# EAGLE design Display18_Cape (EAGLE 7.7.0)
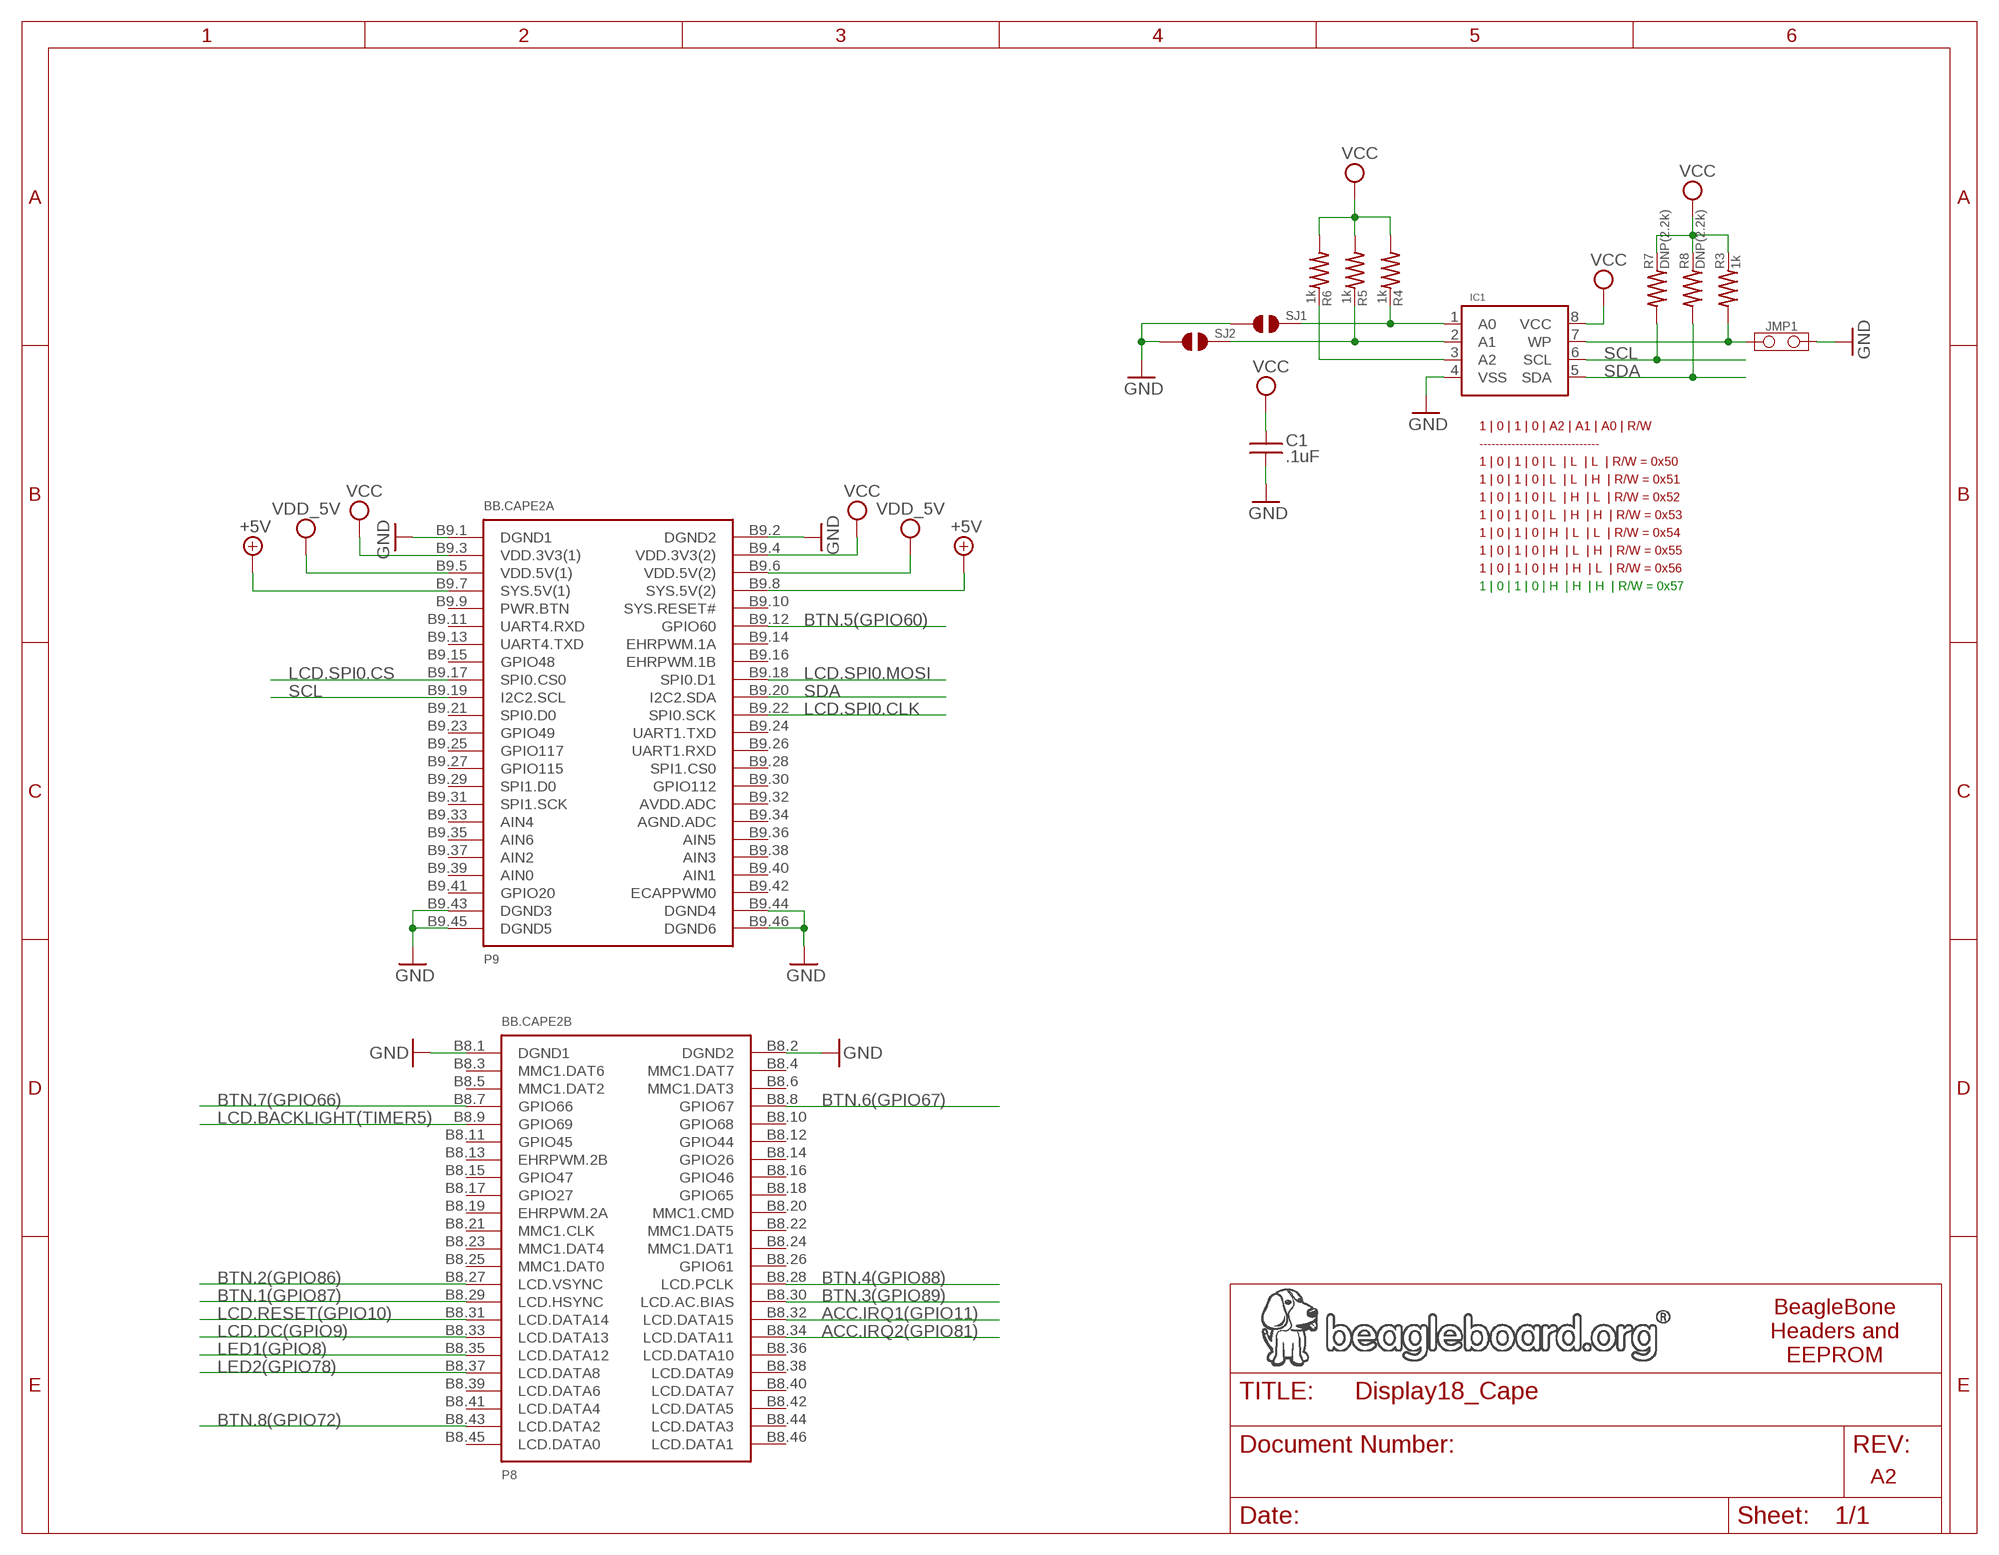
[diagram p0: schematic, sheet 1, part 1 of 2]
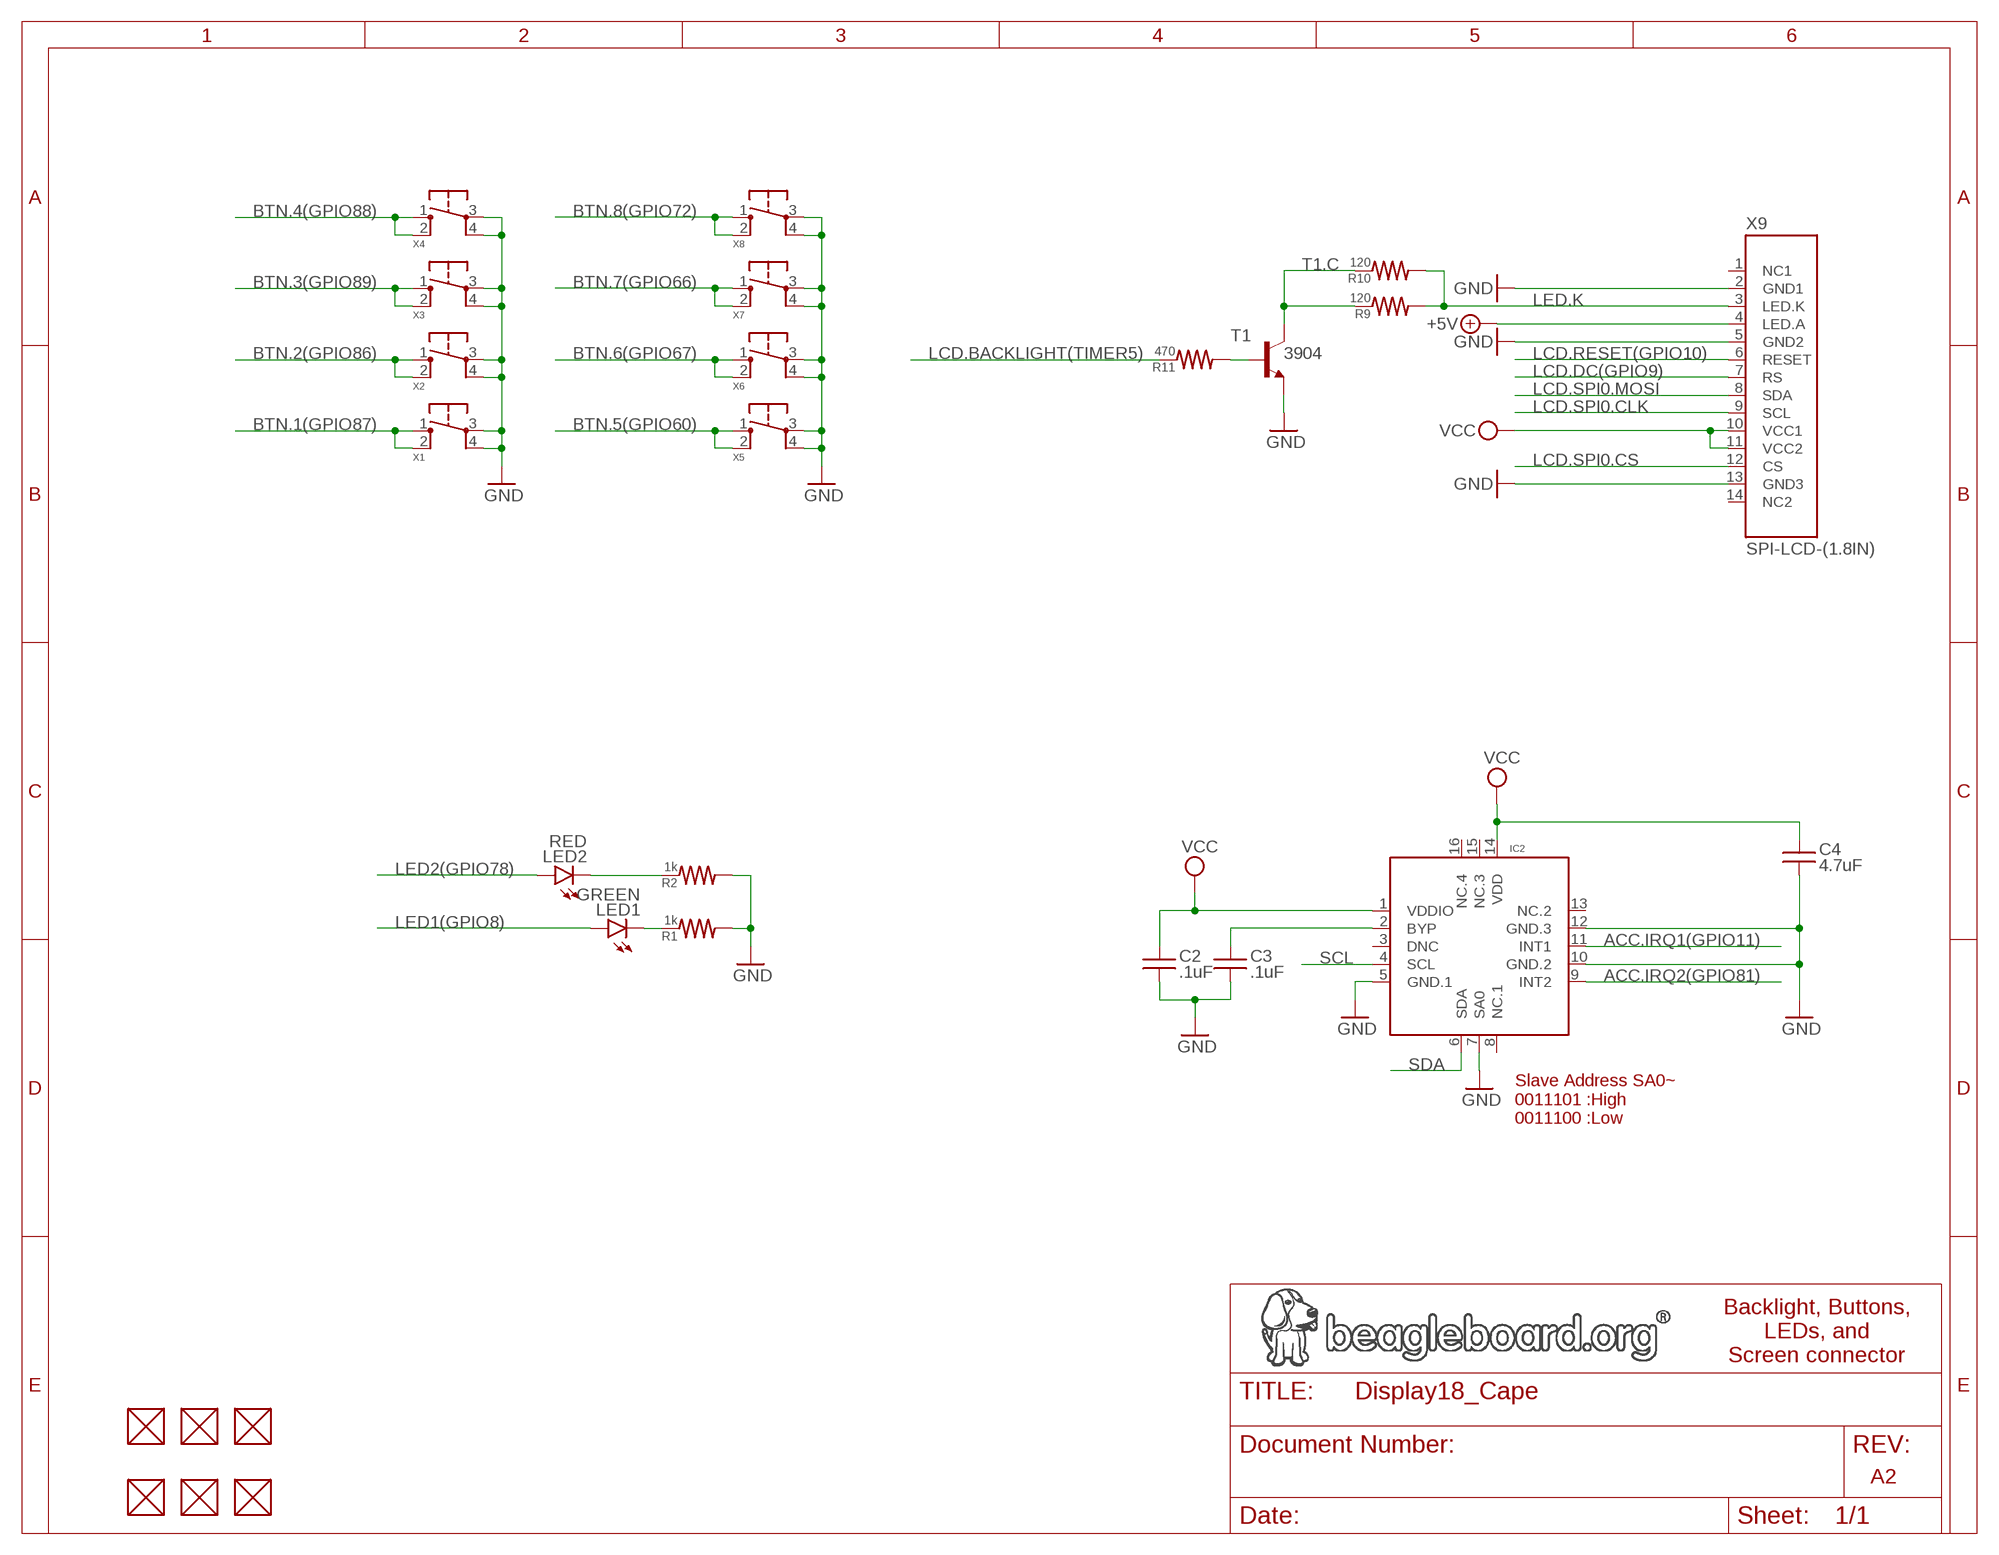
[diagram p1: schematic, sheet 1, part 2 of 2]

## Parts
BB.CAPE2  BEAGLEBONE.CAPE.BOTTOM-ONLY-PADS  [BEAGLEBONE.CAPE.BOTTOM-ONLY-PADS]
C1  .1uF  CAPACITOR-(INCH)-0402  [0402]
C2  .1uF  CAPACITOR-(INCH)-0402  [0402]
C3  .1uF  CAPACITOR-(INCH)-0402  [0402]
C4  4.7uF  CAPACITOR-(INCH)-0603  [0603]
FUD1  FIDUCIAL  [FIDUCIAL_40MIL]
FUD2  FIDUCIAL  [FIDUCIAL_40MIL]
FUD3  FIDUCIAL  [FIDUCIAL_40MIL]
FUD4  FIDUCIAL  [FIDUCIAL_40MIL]
FUD5  FIDUCIAL  [FIDUCIAL_40MIL]
FUD6  FIDUCIAL  [FIDUCIAL_40MIL]
IC1  CAT24C32  [UDFN8,2X3(ON-SEMI)]
IC2  MMA8453Q  [QFN-16-(MMA8453Q)]
JMP1  JUMPER-(X2)  [JUMPER-(X2)]
LED1  GREEN  LED-(INCH)-0805  [0805-LED]
LED2  RED  LED-(INCH)-0805  [0805-LED]
R1  1k  RESISTOR-(INCH)-0402  [0402]
R2  1k  RESISTOR-(INCH)-0402  [0402]
R3  1k  RESISTOR-(INCH)-0402  [0402]
R4  1k  RESISTOR-(INCH)-0402  [0402]
R5  1k  RESISTOR-(INCH)-0402  [0402]
R6  1k  RESISTOR-(INCH)-0402  [0402]
R7  DNP(2.2k)  RESISTOR-(INCH)-0402  [0402]
R8  DNP(2.2k)  RESISTOR-(INCH)-0402  [0402]
R9  120  RESISTOR-(INCH)-0603  [0603]
R10  120  RESISTOR-(INCH)-0603  [0603]
R11  470  RESISTOR-(INCH)-0603  [0603]
SJ1  SOLDER.JOINT-(INCH)-0402  [SOLDER.JOINT(0402)]
SJ2  SOLDER.JOINT-(INCH)-0402  [SOLDER.JOINT(0402)]
T1  3904  BC847-NPN-SOT23-BEC  [SOT23-BEC]
X1  6MM_TACTILE_SWITCH  [6MM_TACTILE-SWITCH]
X2  6MM_TACTILE_SWITCH  [6MM_TACTILE-SWITCH]
X3  6MM_TACTILE_SWITCH  [6MM_TACTILE-SWITCH]
X4  6MM_TACTILE_SWITCH  [6MM_TACTILE-SWITCH]
X5  6MM_TACTILE_SWITCH  [6MM_TACTILE-SWITCH]
X6  6MM_TACTILE_SWITCH  [6MM_TACTILE-SWITCH]
X7  6MM_TACTILE_SWITCH  [6MM_TACTILE-SWITCH]
X8  6MM_TACTILE_SWITCH  [6MM_TACTILE-SWITCH]
X9  SPI-LCD-(1.8IN)  [LCD-(1.8IN)]

## Nets
+5V: BB.CAPE2.B9.7(A:SYS.5V(1)) BB.CAPE2.B9.8(A:SYS.5V(2)) X9.4(LED.A)
A0: IC1.1(A0) R4.2 SJ1.2
A1: IC1.2(A1) R5.2 SJ2.2
A2: IC1.3(A2) R6.2
ACC.IRQ1(GPIO11): BB.CAPE2.B8.32(B:LCD.DATA15) IC2.11(INT1)
ACC.IRQ2(GPIO81): BB.CAPE2.B8.34(B:LCD.DATA11) IC2.9(INT2)
BTN.1(GPIO87): BB.CAPE2.B8.29(B:LCD.HSYNC) X1.1 X1.2
BTN.2(GPIO86): BB.CAPE2.B8.27(B:LCD.VSYNC) X2.1 X2.2
BTN.3(GPIO89): BB.CAPE2.B8.30(B:LCD.AC.BIAS) X3.1 X3.2
BTN.4(GPIO88): BB.CAPE2.B8.28(B:LCD.PCLK) X4.1 X4.2
BTN.5(GPIO60): BB.CAPE2.B9.12(A:GPIO60) X5.1 X5.2
BTN.6(GPIO67): BB.CAPE2.B8.8(B:GPIO67) X6.1 X6.2
BTN.7(GPIO66): BB.CAPE2.B8.7(B:GPIO66) X7.1 X7.2
BTN.8(GPIO72): BB.CAPE2.B8.43(B:LCD.DATA2) X8.1 X8.2
GND: BB.CAPE2.B8.1(B:DGND1) BB.CAPE2.B8.2(B:DGND2) BB.CAPE2.B9.1(A:DGND1) BB.CAPE2.B9.2(A:DGND2) BB.CAPE2.B9.43(A:DGND3) BB.CAPE2.B9.44(A:DGND4) BB.CAPE2.B9.45(A:DGND5) BB.CAPE2.B9.46(A:DGND6) C1.2 C2.2 C3.2 C4.2 IC1.4(VSS) IC2.5(GND.1) IC2.7(SA0) IC2.10(GND.2) IC2.12(GND.3) JMP1.2 R1.1 R2.1 SJ1.1 SJ2.1 T1.E X1.3 X1.4 X2.3 X2.4 X3.3 X3.4 X4.3 X4.4 X5.3 X5.4 X6.3 X6.4 X7.3 X7.4 X8.3 X8.4 X9.2(GND1) X9.5(GND2) X9.13(GND3)
LCD.BACKLIGHT(TIMER5): BB.CAPE2.B8.9(B:GPIO69) R11.2
LCD.DC(GPIO9): BB.CAPE2.B8.33(B:LCD.DATA13) X9.7(RS)
LCD.RESET(GPIO10): BB.CAPE2.B8.31(B:LCD.DATA14) X9.6(RESET)
LCD.SPI0.CLK: BB.CAPE2.B9.22(A:SPI0.SCK) X9.9(SCL)
LCD.SPI0.CS: BB.CAPE2.B9.17(A:SPI0.CS0) X9.12(CS)
LCD.SPI0.MOSI: BB.CAPE2.B9.18(A:SPI0.D1) X9.8(SDA)
LED1(GPIO8): BB.CAPE2.B8.35(B:LCD.DATA12) LED1.A
LED2(GPIO78): BB.CAPE2.B8.37(B:LCD.DATA8) LED2.A
LED.K: R9.1 R10.1 X9.3(LED.K)
N$3: LED2.K R2.2
N$4: LED1.K R1.2
N$5: R11.1 T1.B
N$6: C3.1 IC2.2(BYP)
SCL: BB.CAPE2.B9.19(A:I2C2.SCL) IC1.6(SCL) IC2.4(SCL) R7.1
SDA: BB.CAPE2.B9.20(A:I2C2.SDA) IC1.5(SDA) IC2.6(SDA) R8.1
T1.C: R9.2 R10.2 T1.C
VCC: BB.CAPE2.B9.3(A:VDD.3V3(1)) BB.CAPE2.B9.4(A:VDD.3V3(2)) C1.1 C2.1 C4.1 IC1.8(VCC) IC2.1(VDDIO) IC2.14(VDD) R3.2 R4.1 R5.1 R6.1 R7.2 R8.2 X9.10(VCC1) X9.11(VCC2)
VDD_5V: BB.CAPE2.B9.5(A:VDD.5V(1)) BB.CAPE2.B9.6(A:VDD.5V(2))
WP: IC1.7(WP) JMP1.1 R3.1
Unconnected: BB.CAPE2.B8.3(B:MMC1.DAT6) BB.CAPE2.B8.4(B:MMC1.DAT7) BB.CAPE2.B8.5(B:MMC1.DAT2) BB.CAPE2.B8.6(B:MMC1.DAT3) BB.CAPE2.B8.10(B:GPIO68) BB.CAPE2.B8.11(B:GPIO45) BB.CAPE2.B8.12(B:GPIO44) BB.CAPE2.B8.13(B:EHRPWM.2B) BB.CAPE2.B8.14(B:GPIO26) BB.CAPE2.B8.15(B:GPIO47) BB.CAPE2.B8.16(B:GPIO46) BB.CAPE2.B8.17(B:GPIO27) BB.CAPE2.B8.18(B:GPIO65) BB.CAPE2.B8.19(B:EHRPWM.2A) BB.CAPE2.B8.20(B:MMC1.CMD) BB.CAPE2.B8.21(B:MMC1.CLK) BB.CAPE2.B8.22(B:MMC1.DAT5) BB.CAPE2.B8.23(B:MMC1.DAT4) BB.CAPE2.B8.24(B:MMC1.DAT1) BB.CAPE2.B8.25(B:MMC1.DAT0) BB.CAPE2.B8.26(B:GPIO61) BB.CAPE2.B8.36(B:LCD.DATA10) BB.CAPE2.B8.38(B:LCD.DATA9) BB.CAPE2.B8.39(B:LCD.DATA6) BB.CAPE2.B8.40(B:LCD.DATA7) BB.CAPE2.B8.41(B:LCD.DATA4) BB.CAPE2.B8.42(B:LCD.DATA5) BB.CAPE2.B8.44(B:LCD.DATA3) BB.CAPE2.B8.45(B:LCD.DATA0) BB.CAPE2.B8.46(B:LCD.DATA1) BB.CAPE2.B9.9(A:PWR.BTN) BB.CAPE2.B9.10(A:SYS.RESET#) BB.CAPE2.B9.11(A:UART4.RXD) BB.CAPE2.B9.13(A:UART4.TXD) BB.CAPE2.B9.14(A:EHRPWM.1A) BB.CAPE2.B9.15(A:GPIO48) BB.CAPE2.B9.16(A:EHRPWM.1B) BB.CAPE2.B9.21(A:SPI0.D0) BB.CAPE2.B9.23(A:GPIO49) BB.CAPE2.B9.24(A:UART1.TXD) BB.CAPE2.B9.25(A:GPIO117) BB.CAPE2.B9.26(A:UART1.RXD) BB.CAPE2.B9.27(A:GPIO115) BB.CAPE2.B9.28(A:SPI1.CS0) BB.CAPE2.B9.29(A:SPI1.D0) BB.CAPE2.B9.30(A:GPIO112) BB.CAPE2.B9.31(A:SPI1.SCK) BB.CAPE2.B9.32(A:AVDD.ADC) BB.CAPE2.B9.33(A:AIN4) BB.CAPE2.B9.34(A:AGND.ADC) BB.CAPE2.B9.35(A:AIN6) BB.CAPE2.B9.36(A:AIN5) BB.CAPE2.B9.37(A:AIN2) BB.CAPE2.B9.38(A:AIN3) BB.CAPE2.B9.39(A:AIN0) BB.CAPE2.B9.40(A:AIN1) BB.CAPE2.B9.41(A:GPIO20) BB.CAPE2.B9.42(A:ECAPPWM0) FUD1.P$1 FUD2.P$1 FUD3.P$1 FUD4.P$1 FUD5.P$1 FUD6.P$1 IC2.3(DNC) IC2.8(NC.1) IC2.13(NC.2) IC2.15(NC.3) IC2.16(NC.4) X9.1(NC1) X9.14(NC2)

## Notes on the sheet
- 1 | 0 | 1 | 0 | A2 | A1 | A0 | R/W
- ------------------------------
- 1 | 0 | 1 | 0 | L  | L  | L  | R/W = 0x50
- 1 | 0 | 1 | 0 | L  | L  | H  | R/W = 0x51
- 1 | 0 | 1 | 0 | L  | H  | L  | R/W = 0x52
- 1 | 0 | 1 | 0 | L  | H  | H  | R/W = 0x53
- 1 | 0 | 1 | 0 | H  | L  | L  | R/W = 0x54
- 1 | 0 | 1 | 0 | H  | L  | H  | R/W = 0x55
- 1 | 0 | 1 | 0 | H  | H  | L  | R/W = 0x56
- 1 | 0 | 1 | 0 | H  | H  | H  | R/W = 0x57
- Slave Address SA0~
  0011101 :High
  0011100 :Low
- BeagleBone
  Headers and
  EEPROM
- Backlight, Buttons,
  LEDs, and
  Screen connector
- A2 | A2

## Library data of the parts
BB.CAPE2 = GHI-Solutions:BEAGLEBONE.CAPE
C1-C4 = GHI-BasicComponents:CAPACITOR-(INCH)-: Basic SMD ceramic capacitors
FUD1-FUD6 = GHI:FIDUCIAL
IC1 = GHI-IC:CAT24C32: 32-Kb I2C CMOS Serial EEPROM
IC2 = GHI-IC:MMA8453Q: MMA8453Q, 3-axis, 10-bit/8-bit digital accelerometer
JMP1 = GHI-Headers:JUMPER-(X2)
LED1 LED2 = GHI-BasicComponents:LED-(INCH)-: Basic SMD LEDs
R1-R11 = GHI-BasicComponents:RESISTOR-(INCH)-: Basic SMD Resistors
SJ1 SJ2 = GHI-Miscellaneous:SOLDER.JOINT-(INCH)-: Solder Joint (Bridge) Pads - For easy solder joining.
T1 = transistor:*-NPN-: NPN Transistror BF959 corrected 2008.03.06
X1-X8 = GHI2:6MM_TACTILE_SWITCH
X9 = GHI-Connectors:SPI-LCD-(1.8IN)

## Board
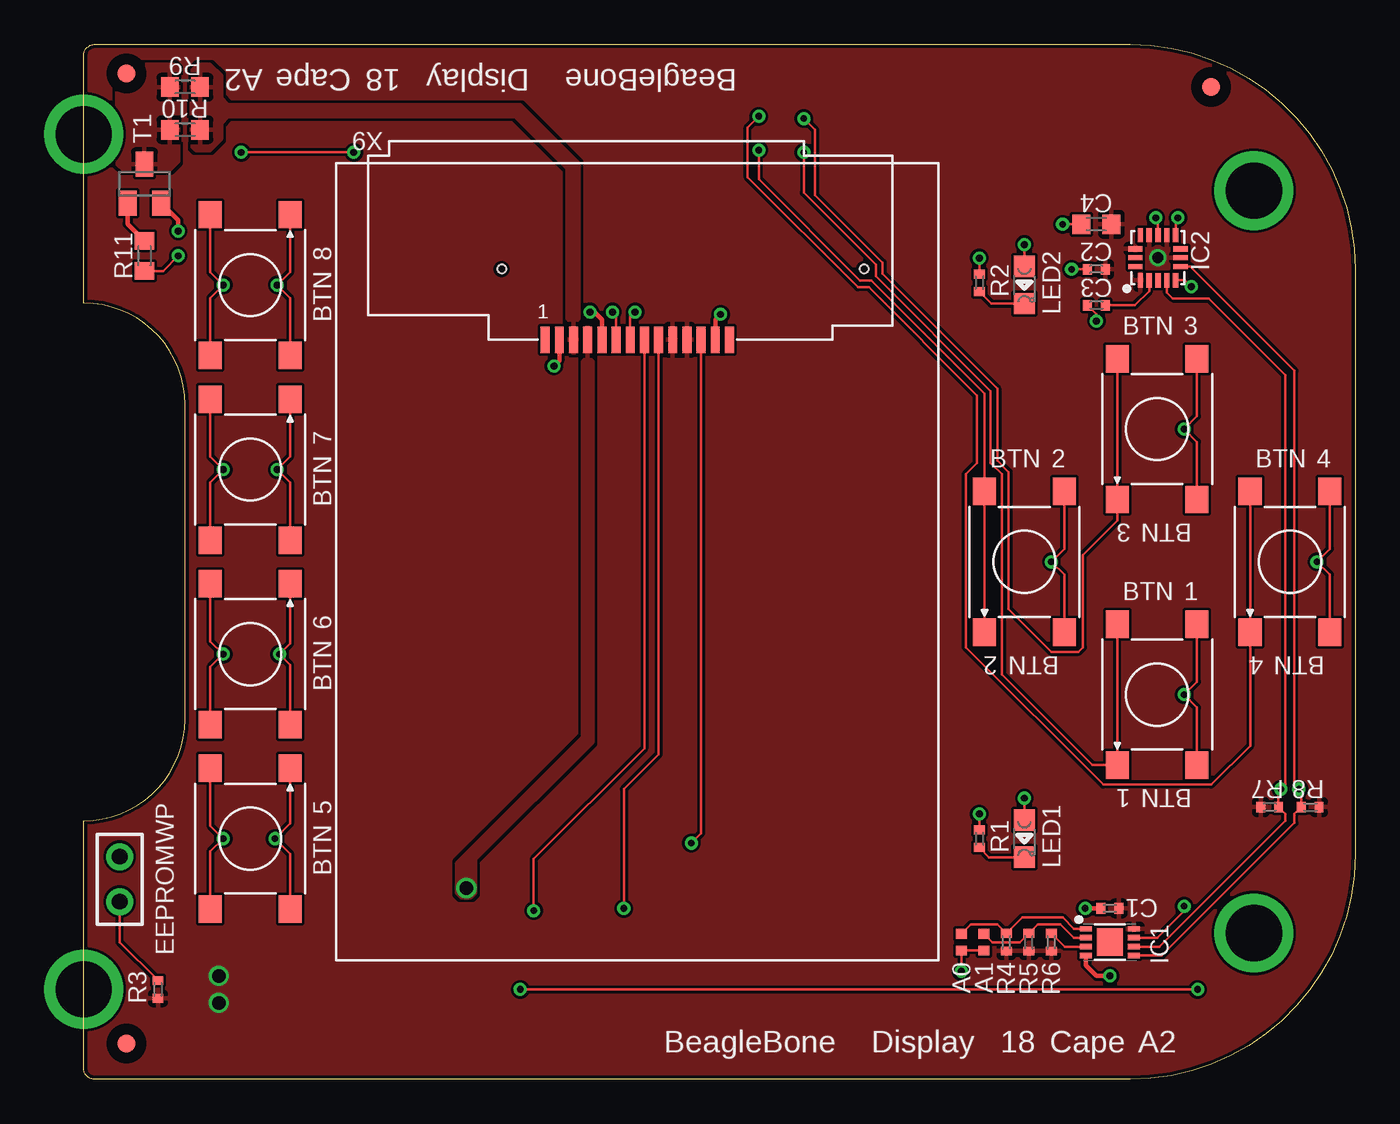
[diagram p2: board, top side]
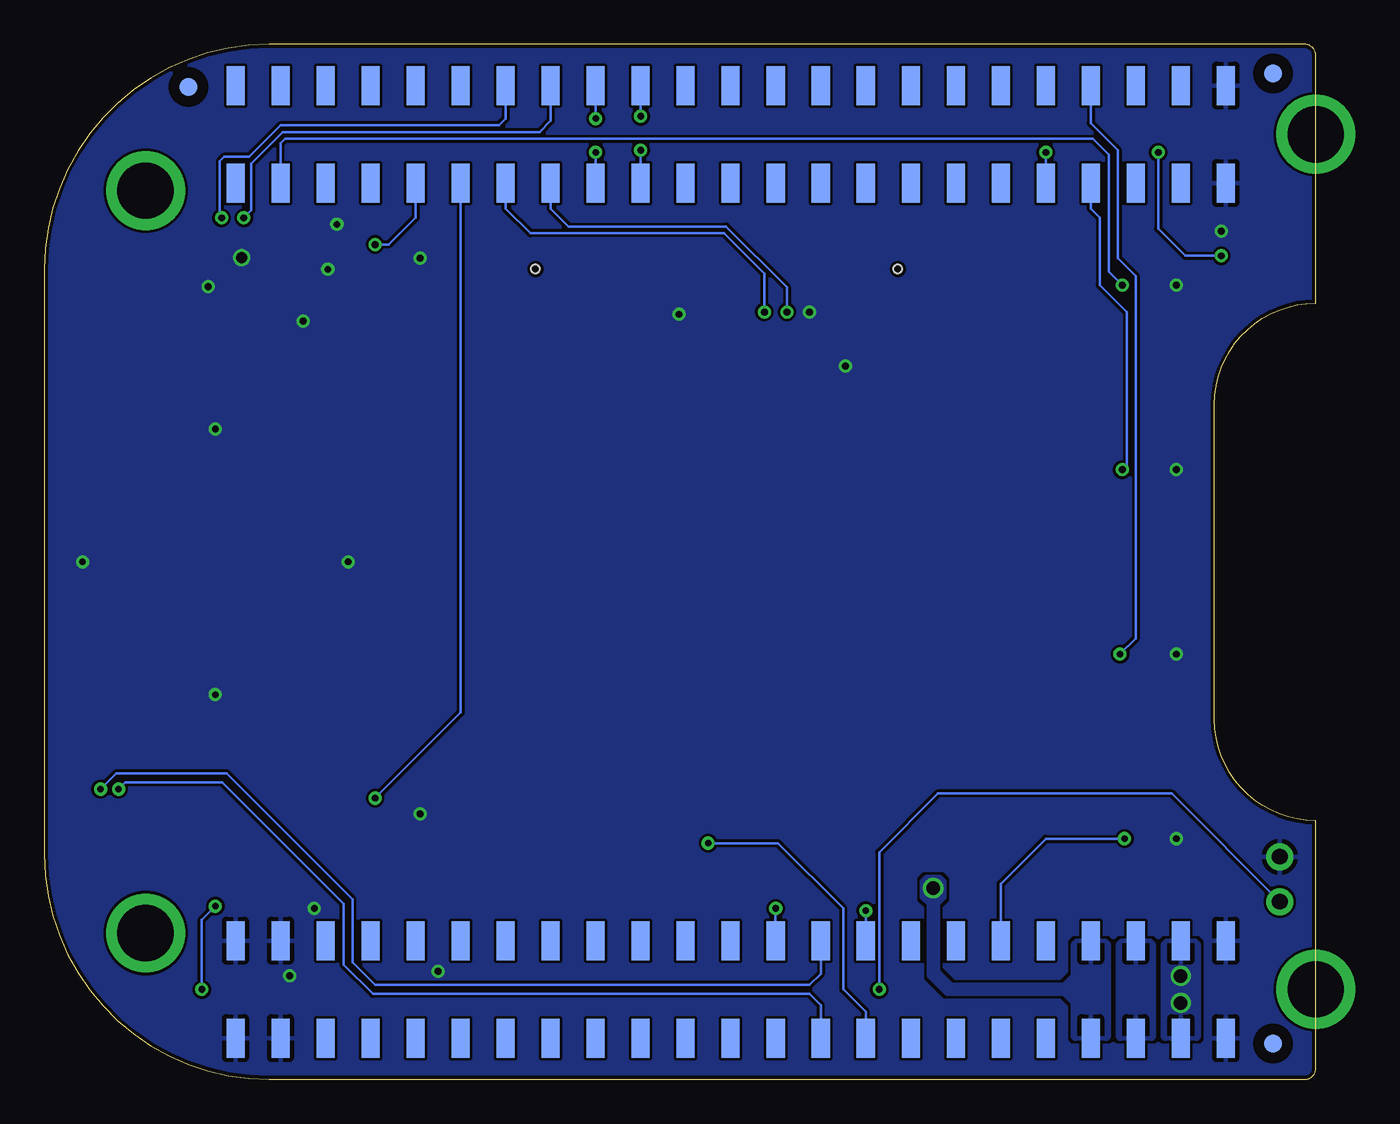
[diagram p3: board, bottom side, seen from below]

Size 71.75 x 58.42 mm. Coordinates in mm from the lower left corner, seen from the top.
Copper layers (1+16): Top 0.035mm / dielectric 1.5mm / Bottom 0.035mm
Design rules "SparkFun-2-layer *": minimum track width 6mil, minimum drill 15mil, track to track 6mil, track to pad 6mil, pad to pad 6mil, via to via 6mil, smd to smd 6mil, copper to edge 8mil, drill to drill 8mil, minimum pad ring 12mil, minimum via ring 7mil, stop-mask expansion 4mil, vias tented up to drill 32mil, thermal gap 10mil
tRestrict: area 33.5,41.5 to 33.8,41.9

### Footprints (pad centres in the part's own frame; a part is rotated, then mirrored left to right if it is on the bottom)
BEAGLEBONE.CAPE.BOTTOM-ONLY-PADS = smd 1.02 x 2.2 bottom: B8.1 5.08,50.59; B8.2 5.08,56.09; B8.3 7.62,50.59; B8.4 7.62,56.09; B8.5 10.16,50.59; B8.6 10.16,56.09; B8.7 12.7,50.59; B8.8 12.7,56.09; B8.9 15.24,50.59; B8.10 15.24,56.09; B8.11 17.78,50.59; B8.12 17.78,56.09; B8.13 20.32,50.59; B8.14 20.32,56.09; B8.15 22.86,50.59; B8.16 22.86,56.09; B8.17 25.4,50.59; B8.18 25.4,56.09; B8.19 27.94,50.59; B8.20 27.94,56.09; B8.21 30.48,50.59; B8.22 30.48,56.09; B8.23 33.02,50.59; B8.24 33.02,56.09; B8.25 35.56,50.59; B8.26 35.56,56.09; B8.27 38.1,50.59; B8.28 38.1,56.09; B8.29 40.64,50.59; B8.30 40.64,56.09; B8.31 43.18,50.59; B8.32 43.18,56.09; B8.33 45.72,50.59; B8.34 45.72,56.09; B8.35 48.26,50.59; B8.36 48.26,56.09; B8.37 50.8,50.59; B8.38 50.8,56.09; B8.39 53.34,50.59; B8.40 53.34,56.09; B8.41 55.88,50.59; B8.42 55.88,56.09; B8.43 58.42,50.59; B8.44 58.42,56.09; B8.45 60.96,50.59; B8.46 60.96,56.09; B9.1 5.08,2.33; B9.2 5.08,7.83; B9.3 7.62,2.33; B9.4 7.62,7.83; B9.5 10.16,2.33; B9.6 10.16,7.83; B9.7 12.7,2.33; B9.8 12.7,7.83; B9.9 15.24,2.33; B9.10 15.24,7.83; B9.11 17.78,2.33; B9.12 17.78,7.83; B9.13 20.32,2.33; B9.14 20.32,7.83; B9.15 22.86,2.33; B9.16 22.86,7.83; B9.17 25.4,2.33; B9.18 25.4,7.83; B9.19 27.94,2.33; B9.20 27.94,7.83; B9.21 30.48,2.33; B9.22 30.48,7.83; B9.23 33.02,2.33; B9.24 33.02,7.83; B9.25 35.56,2.33; B9.26 35.56,7.83; B9.27 38.1,2.33; B9.28 38.1,7.83; B9.29 40.64,2.33; B9.30 40.64,7.83; B9.31 43.18,2.33; B9.32 43.18,7.83; B9.33 45.72,2.33; B9.34 45.72,7.83; B9.35 48.26,2.33; B9.36 48.26,7.83; B9.37 50.8,2.33; B9.38 50.8,7.83; B9.39 53.34,2.33; B9.40 53.34,7.83; B9.41 55.88,2.33; B9.42 55.88,7.83; B9.43 58.42,2.33; B9.44 58.42,7.83; B9.45 60.96,2.33; B9.46 60.96,7.83 | drill 3.175 pad 4.445: MH.1 0,5.08; MH.2 66.04,8.255; MH.3 66.04,50.165; MH.4 0,53.34
0402 = smd 0.5 x 0.6: 1 -0.5,0; 2 0.5,0
0603 = smd 1 x 1.1: 1 -0.85,0; 2 0.85,0
FIDUCIAL_40MIL = smd 1.016 x 1.016: P$1 0,0
UDFN8,2X3(ON-SEMI) = smd 0.3 x 0.68: 1 0.75,1.36; 2 0.25,1.36; 3 -0.25,1.36; 4 -0.75,1.36; 5 -0.75,-1.36; 6 -0.25,-1.36; 7 0.25,-1.36; 8 0.75,-1.36 | smd 1.56 x 1.45: P$1 0,0
QFN-16-(MMA8453Q) = smd 0.813 x 0.295: 1 1.275,-1; 2 1.275,-0.5; 3 1.275,0; 4 1.275,0.5; 5 1.275,1; 9 -1.275,1; 10 -1.275,0.5; 11 -1.275,0; 12 -1.275,-0.5; 13 -1.275,-1 | smd 0.295 x 0.813: 6 0.5,1.275; 7 0,1.275; 8 -0.5,1.275; 14 -0.5,-1.275; 15 0,-1.275; 16 0.5,-1.275
JUMPER-(X2) = drill 0.889 pad 1.524: 1 -1.27,0; 2 1.27,0
0805-LED = smd 1.2 x 1.2: A 0,1.05; K 0,-1.05
SOLDER.JOINT(0402) = smd 0.55 x 0.6: 1 -0.475,0; 2 0.475,0
SOT23-BEC = smd 1 x 1.4: B -0.95,-1.1; C 0,1.1; E 0.95,-1.1
6MM_TACTILE-SWITCH = smd 1.55 x 1.3: 1 -3.975,2.25; 2 3.975,2.25; 3 -3.975,-2.25; 4 3.975,-2.25
LCD-(1.8IN) = smd 0.5 x 1.5: 1 5.2,-12.532; 2 4.4,-12.532; 3 3.6,-12.532; 4 2.8,-12.532; 5 2,-12.532; 6 1.2,-12.532; 7 0.4,-12.532; 8 -0.4,-12.532; 9 -1.2,-12.532; 10 -2,-12.532; 11 -2.8,-12.532; 12 -3.6,-12.532; 13 -4.4,-12.532; 14 -5.2,-12.532 | hole 0.5: -12.8,-16.532; 7.65,-16.532

### Placement (x,y rotation side)
BB.CAPE2  0,0 0 top
C1  57.91,9.65 180 top
C2  57.15,45.72 180 top
C3  57.15,43.69 180 top
C4  57.15,48.26 180 top
FUD1  2.41,2.03 0 top
FUD2  63.63,56.01 0 top
FUD3  2.41,56.77 0 top
FUD4  2.41,2.03 0 bottom
FUD5  63.63,56.01 0 bottom
FUD6  2.41,56.77 0 bottom
IC1  57.91,7.75 90 top
IC2  60.62,46.38 270 top
JMP1  2.03,11.3 90 top
LED1  53.09,13.59 0 top
LED2  53.09,44.83 0 top
R1  50.55,13.59 270 top
R2  50.55,44.96 270 top
R3  4.19,5.08 270 top
R4  52.07,7.75 90 top
R5  53.34,7.75 90 top
R6  54.61,7.75 90 top
R7  66.93,15.37 180 top
R8  69.22,15.37 0 top
R9  5.71,56.01 180 top
R10  5.71,53.59 180 top
R11  3.43,46.48 270 top
SJ1  49.53,7.75 90 top
SJ2  50.8,7.75 90 top
T1  3.43,50.55 0 top
X1  60.58,21.72 90 top
X2  53.09,29.21 90 top
X3  60.58,36.7 90 top
X4  68.07,29.21 90 top
X5  9.4,13.59 270 top
X6  9.4,24 270 top
X7  9.4,34.42 270 top
X8  9.4,44.83 270 top
X9  31.24,29.21 180 top

### Tracks (layer width: path | path; a pad name or v marks a point on that pad's centre or on a via)
+5V  (via drill 0.76 pad 0.18)
  other vias: 21.59,10.79
  pour Bottom: 11.68,7.62 11.68,2.41 12.06,2.03 13.34,2.03 13.72,2.41 13.72,4.32 14.22,4.83 20.83,4.83 21.84,5.84 21.84,9.91 22.23,10.29 22.23,11.18 21.97,11.43 21.21,11.43 20.95,11.18 20.95,10.29 21.34,9.91 21.34,6.1 20.57,5.33 14.22,5.33 13.72,5.84 13.72,7.62 13.21,8.13 12.19,8.13
  pour Top: 28.19,19.3 21.08,12.19 21.08,10.54 21.34,10.29 21.84,10.29 22.1,10.54 22.1,12.45 28.7,19.05 28.7,40.51 28.57,40.64 28.57,42.42 28.32,42.42 28.32,40.64 28.19,40.51
A0
  Top 0.152: SJ1.2 50.07,8.76 51.55,8.76 R4.2 52.97,9.14 55.24,9.14 55.89,8.5 IC1.1
A1
  Top 0.152: SJ2.2 51.27,7.75 52.84,7.75 R5.2 53.86,8.76 55.12,8.76 55.88,8 IC1.2
A2
  Top 0.152: 54.62,8.26 R6.2 55.36,7.5 IC1.3
ACC.IRQ1(GPIO11)  (via drill 0.38 pad 0.18)
  Top 0.152: IC2.11 60.62,48.5 v60.5,48.62
  Bottom 0.152: BB.CAPE2.B8.32 43.18,54.1 43.81,53.47 58.29,53.47 60.07,51.69 60.07,49.05 v60.5,48.62
ACC.IRQ2(GPIO81)  (via drill 0.38 pad 0.18)
  Top 0.152: IC2.9 61.62,48.5 v61.75,48.62
  Bottom 0.152: BB.CAPE2.B8.34 45.72,54.23 46.1,53.85 58.42,53.85 60.2,52.07 61.59,52.07 61.85,51.82 61.85,48.72 v61.75,48.62
BTN.1(GPIO87)  (via drill 0.38 pad 0.18)
  Top 0.152: X1.2 X1.1 56.93,17.74 51.82,22.86 51.82,34.16 51.18,34.8 51.18,38.86 44.7,45.34 44.7,45.97 40.64,50.04 v40.64,52.32
  Bottom 0.152: BB.CAPE2.B8.29 v40.64,52.32
BTN.2(GPIO86)  (via drill 0.38 pad 0.18)
  Top 0.152: X2.1 X2.2 50.84,38.7 44.45,45.09 43.81,45.09 38.1,50.8 v38.1,52.45
  Bottom 0.152: BB.CAPE2.B8.27 v38.1,52.45
BTN.3(GPIO89)  (via drill 0.38 pad 0.18)
  Top 0.152: X3.2 X3.1 58.33,31.53 56.39,29.59 56.39,24.38 56.13,24.13 54.61,24.13 52.2,26.54 52.2,34.29 51.56,34.92 51.56,38.99 45.09,45.47 45.09,46.1 41.27,49.91 41.27,53.59 v40.64,54.23
  Bottom 0.152: BB.CAPE2.B8.30 v40.64,54.23
BTN.4(GPIO88)  (via drill 0.38 pad 0.18)
  Top 0.152: X4.2 X4.1 65.82,18.83 63.63,16.64 57.53,16.64 49.78,24.38 49.78,34.16 50.42,34.8 50.42,38.61 44.32,44.7 43.69,44.7 37.47,50.93 37.47,53.72 v38.1,54.36
  Bottom 0.152: BB.CAPE2.B8.28 v38.1,54.36
BTN.5(GPIO60)  (via drill 0.38 pad 0.18)
  Top 0.152: X5.2 11.65,12.74 v10.79,13.59 11.65,14.44 X5.1
  Bottom 0.152: BB.CAPE2.B9.12 17.78,11.05 15.24,13.59 v10.79,13.59
BTN.6(GPIO67)  (via drill 0.38 pad 0.18)
  Top 0.152: X6.1 11.65,24.6 v11.05,24 11.65,23.4 X6.2
  Bottom 0.152: BB.CAPE2.B8.8 12.7,53.98 11.18,52.45 11.18,46.35 10.16,45.34 10.16,24.89 v11.05,24
BTN.7(GPIO66)  (via drill 0.38 pad 0.18)
  Top 0.152: X7.2 11.65,33.69 v10.92,34.42 11.65,35.14 X7.1
  Bottom 0.152: BB.CAPE2.B8.7 12.7,49.15 12.19,48.64 12.19,44.83 10.67,43.31 10.67,34.67 v10.92,34.42
BTN.8(GPIO72)  (via drill 0.38 pad 0.18)
  Top 0.152: X8.2 11.65,44.1 v10.92,44.83 11.65,45.56 X8.1
  Bottom 0.152: BB.CAPE2.B8.43 58.42,52.83 58.17,53.09 12.57,53.09 11.68,52.2 11.68,45.59 v10.92,44.83
GND  (via drill 0.38 pad 0.18, 0.61 pad 0.18)
  Top 0.152: X8.3 7.15,45.56 v7.87,44.83 7.15,44.1 X8.4 | X7.3 7.15,35.14 v7.87,34.42 7.15,33.69 X7.4 | X6.3 7.15,24.73 v7.87,24 7.15,23.28 X6.4 | X5.3 7.15,14.31 v7.87,13.59 7.15,12.86 X5.4 | X2.3 55.34,28.48 v54.61,29.21 55.34,29.94 X2.4 | X3.3 62.83,35.98 v62.1,36.7 62.83,37.43 X3.4 | X1.3 62.83,20.99 v62.1,21.72 62.83,22.44 X1.4 | X4.3 70.32,28.48 v69.6,29.21 70.32,29.94 X4.4 | SJ2.1 SJ1.1 v49.53,6.1 | IC2.5 62.15,45.1 v62.5,44.75 | C3.2 57.15,43.19 v57.15,42.8 | C2.2 v55.75,45.72 | C4.2 v55.24,48.26 | R1.1 v50.55,14.99 | R2.1 v50.55,46.35
  Top 0.254: C1.2 v56.52,9.65 | T1.E 5.33,48.49 v5.33,47.88 | IC1.4 56.55,6.44 57.15,5.84 v57.91,5.84 | X9.13 35.64,42.88 v35.94,43.18 | X9.2 26.84,40.56 v26.54,40.26 | X9.5 29.24,42.89 28.83,43.31 v28.57,43.31
  other vias: 60.62,46.38
  pour Bottom (rank 2): 72.39,59.05 -0.64,59.05 -0.64,-0.64 72.39,-0.64
  pour Top: 61.62,45.75 59.62,45.75 59.62,47.38 61.62,47.38
LCD.BACKLIGHT(TIMER5)  (via drill 0.38 pad 0.18)
  Top 0.152: v15.24,52.32 v8.89,52.32 | v5.33,46.48 4.48,45.63 R11.2
  Bottom 0.152: BB.CAPE2.B8.9 v15.24,52.32 | v8.89,52.32 8.89,48.01 7.37,46.48 v5.33,46.48
LCD.DC(GPIO9)  (via drill 0.38 pad 0.18)
  Top 0.152: X9.7 30.84,43.03 v31.11,43.31
  Bottom 0.152: v31.11,43.31 31.11,45.47 33.4,47.75 44.32,47.75 45.72,49.15 BB.CAPE2.B8.33
LCD.RESET(GPIO10)  (via drill 0.38 pad 0.18)
  Top 0.152: v29.84,43.31 30.04,43.11 X9.6
  Bottom 0.152: BB.CAPE2.B8.31 43.18,49.15 42.16,48.13 33.27,48.13 29.84,44.7 v29.84,43.31
LCD.SPI0.CLK  (via drill 0.38 pad 0.18)
  Top 0.152: X9.9 32.44,18.34 30.48,16.38 v30.48,9.65
  Bottom 0.152: BB.CAPE2.B9.22 v30.48,9.65
LCD.SPI0.CS  (via drill 0.38 pad 0.18)
  Top 0.152: X9.12 34.84,13.89 v34.29,13.34
  Bottom 0.152: BB.CAPE2.B9.17 25.4,3.81 26.67,5.08 26.67,9.65 30.35,13.34 v34.29,13.34
LCD.SPI0.MOSI  (via drill 0.38 pad 0.18)
  Top 0.152: X9.8 31.64,18.69 25.4,12.45 v25.4,9.53
  Bottom 0.152: BB.CAPE2.B9.18 v25.4,9.53
LED1(GPIO8)  (via drill 0.38 pad 0.18)
  Top 0.152: v53.09,15.88 LED1.A
  Bottom 0.152: BB.CAPE2.B8.35 48.26,20.7 v53.09,15.88
LED2(GPIO78)  (via drill 0.38 pad 0.18)
  Top 0.152: LED2.A v53.09,47.12
  Bottom 0.152: BB.CAPE2.B8.37 50.8,48.64 52.32,47.12 v53.09,47.12
LED.K
  pour Top: 7.11,57.28 6.48,57.28 6.1,56.9 6.1,52.7 6.35,52.45 7.11,52.45 7.75,53.09 7.75,53.98 8.13,54.36 24.38,54.36 27.3,51.44 27.3,42.93 27.43,42.8 27.43,41.02 27.81,41.02 27.81,42.8 27.94,42.93 27.94,51.69 24.64,54.99 8.13,54.99 7.75,55.37 7.75,56.64
N$3
  Top 0.152: R2.2 51.22,43.78 LED2.K
N$4
  Top 0.152: R1.2 51.1,12.54 LED1.K
N$5
  Top 0.254: T1.B 2.48,48.28 R11.1
N$6
  Top 0.152: C3.1 59.31,43.69 60.12,44.5 IC2.2
SCL  (via drill 0.38 pad 0.18)
  Top 0.152: IC1.6 60.71,7.5 67.82,14.61 67.82,14.98 R7.1 67.43,16.25 v67.56,16.38 67.82,16.64 67.82,39.75 63.5,44.07 61.47,44.07 61.12,44.41 IC2.4
  Bottom 0.152: BB.CAPE2.B9.19 27.94,4.19 28.57,4.83 53.21,4.83 54.86,6.48 54.86,9.91 61.72,16.76 67.18,16.76 v67.56,16.38
SDA  (via drill 0.38 pad 0.18)
  Top 0.152: IC1.5 60.84,7 68.33,14.48 68.33,14.98 R8.1 68.72,16.25 v68.58,16.38 68.33,16.64 68.33,40.01 62.46,45.88 IC2.6
  Bottom 0.152: BB.CAPE2.B9.20 27.94,5.97 28.57,5.33 53.09,5.33 54.36,6.6 54.36,10.16 61.47,17.27 67.69,17.27 v68.58,16.38
T1.C
  pour Top: 4.83,51.31 2.29,51.31 1.91,51.69 1.91,56.9 2.29,57.28 5.08,57.28 5.33,57.02 5.33,51.82
VCC  (via drill 0.76 pad 0.18)
  other vias: 7.62,5.84 7.62,4.32
  pour Top (rank 2): -1.27,59.69 -1.27,-1.27 73.03,-1.27 73.03,59.69
  pour Bottom: 6.6,7.62 6.6,2.41 6.99,2.03 8.26,2.03 8.64,2.41 8.64,7.62 8.13,8.13 7.11,8.13
VDD_5V
  pour Bottom: 9.14,7.62 9.14,2.41 9.53,2.03 10.79,2.03 11.18,2.41 11.18,7.62 10.67,8.13 9.65,8.13
WP  (via drill 0.38 pad 0.18)
  Top 0.152: R3.1 2.03,7.74 JMP1.1 | IC1.7 60.58,8 62.1,9.53 v62.1,9.78 | v24.64,5.08 v62.87,5.08
  Bottom 0.152: v62.87,5.08 62.87,9.02 v62.1,9.78 | JMP1.1 8.13,16.13 21.34,16.13 24.64,12.83 v24.64,5.08

### Text on the board
tPlace: A2 | Cape | 18 | Display | BeagleBone | 8 | BTN | BTN | 3 | 7 | BTN | 2 | BTN | 4 | BTN | 3 | BTN | BTN | 1 | 6 | BTN | 2 | BTN | 4 | BTN | 1 | BTN | 5 | WP | BTN | EEPROM | A0 | A1 | BeagleBone | Display | 18 | Cape | A2